# Altium schematic sheet CW_demcheva_ControlBoard_Sh1.SchDoc: =title_line_1 + title_line_2
size 840 x 594 mm; SheetNumber: 1
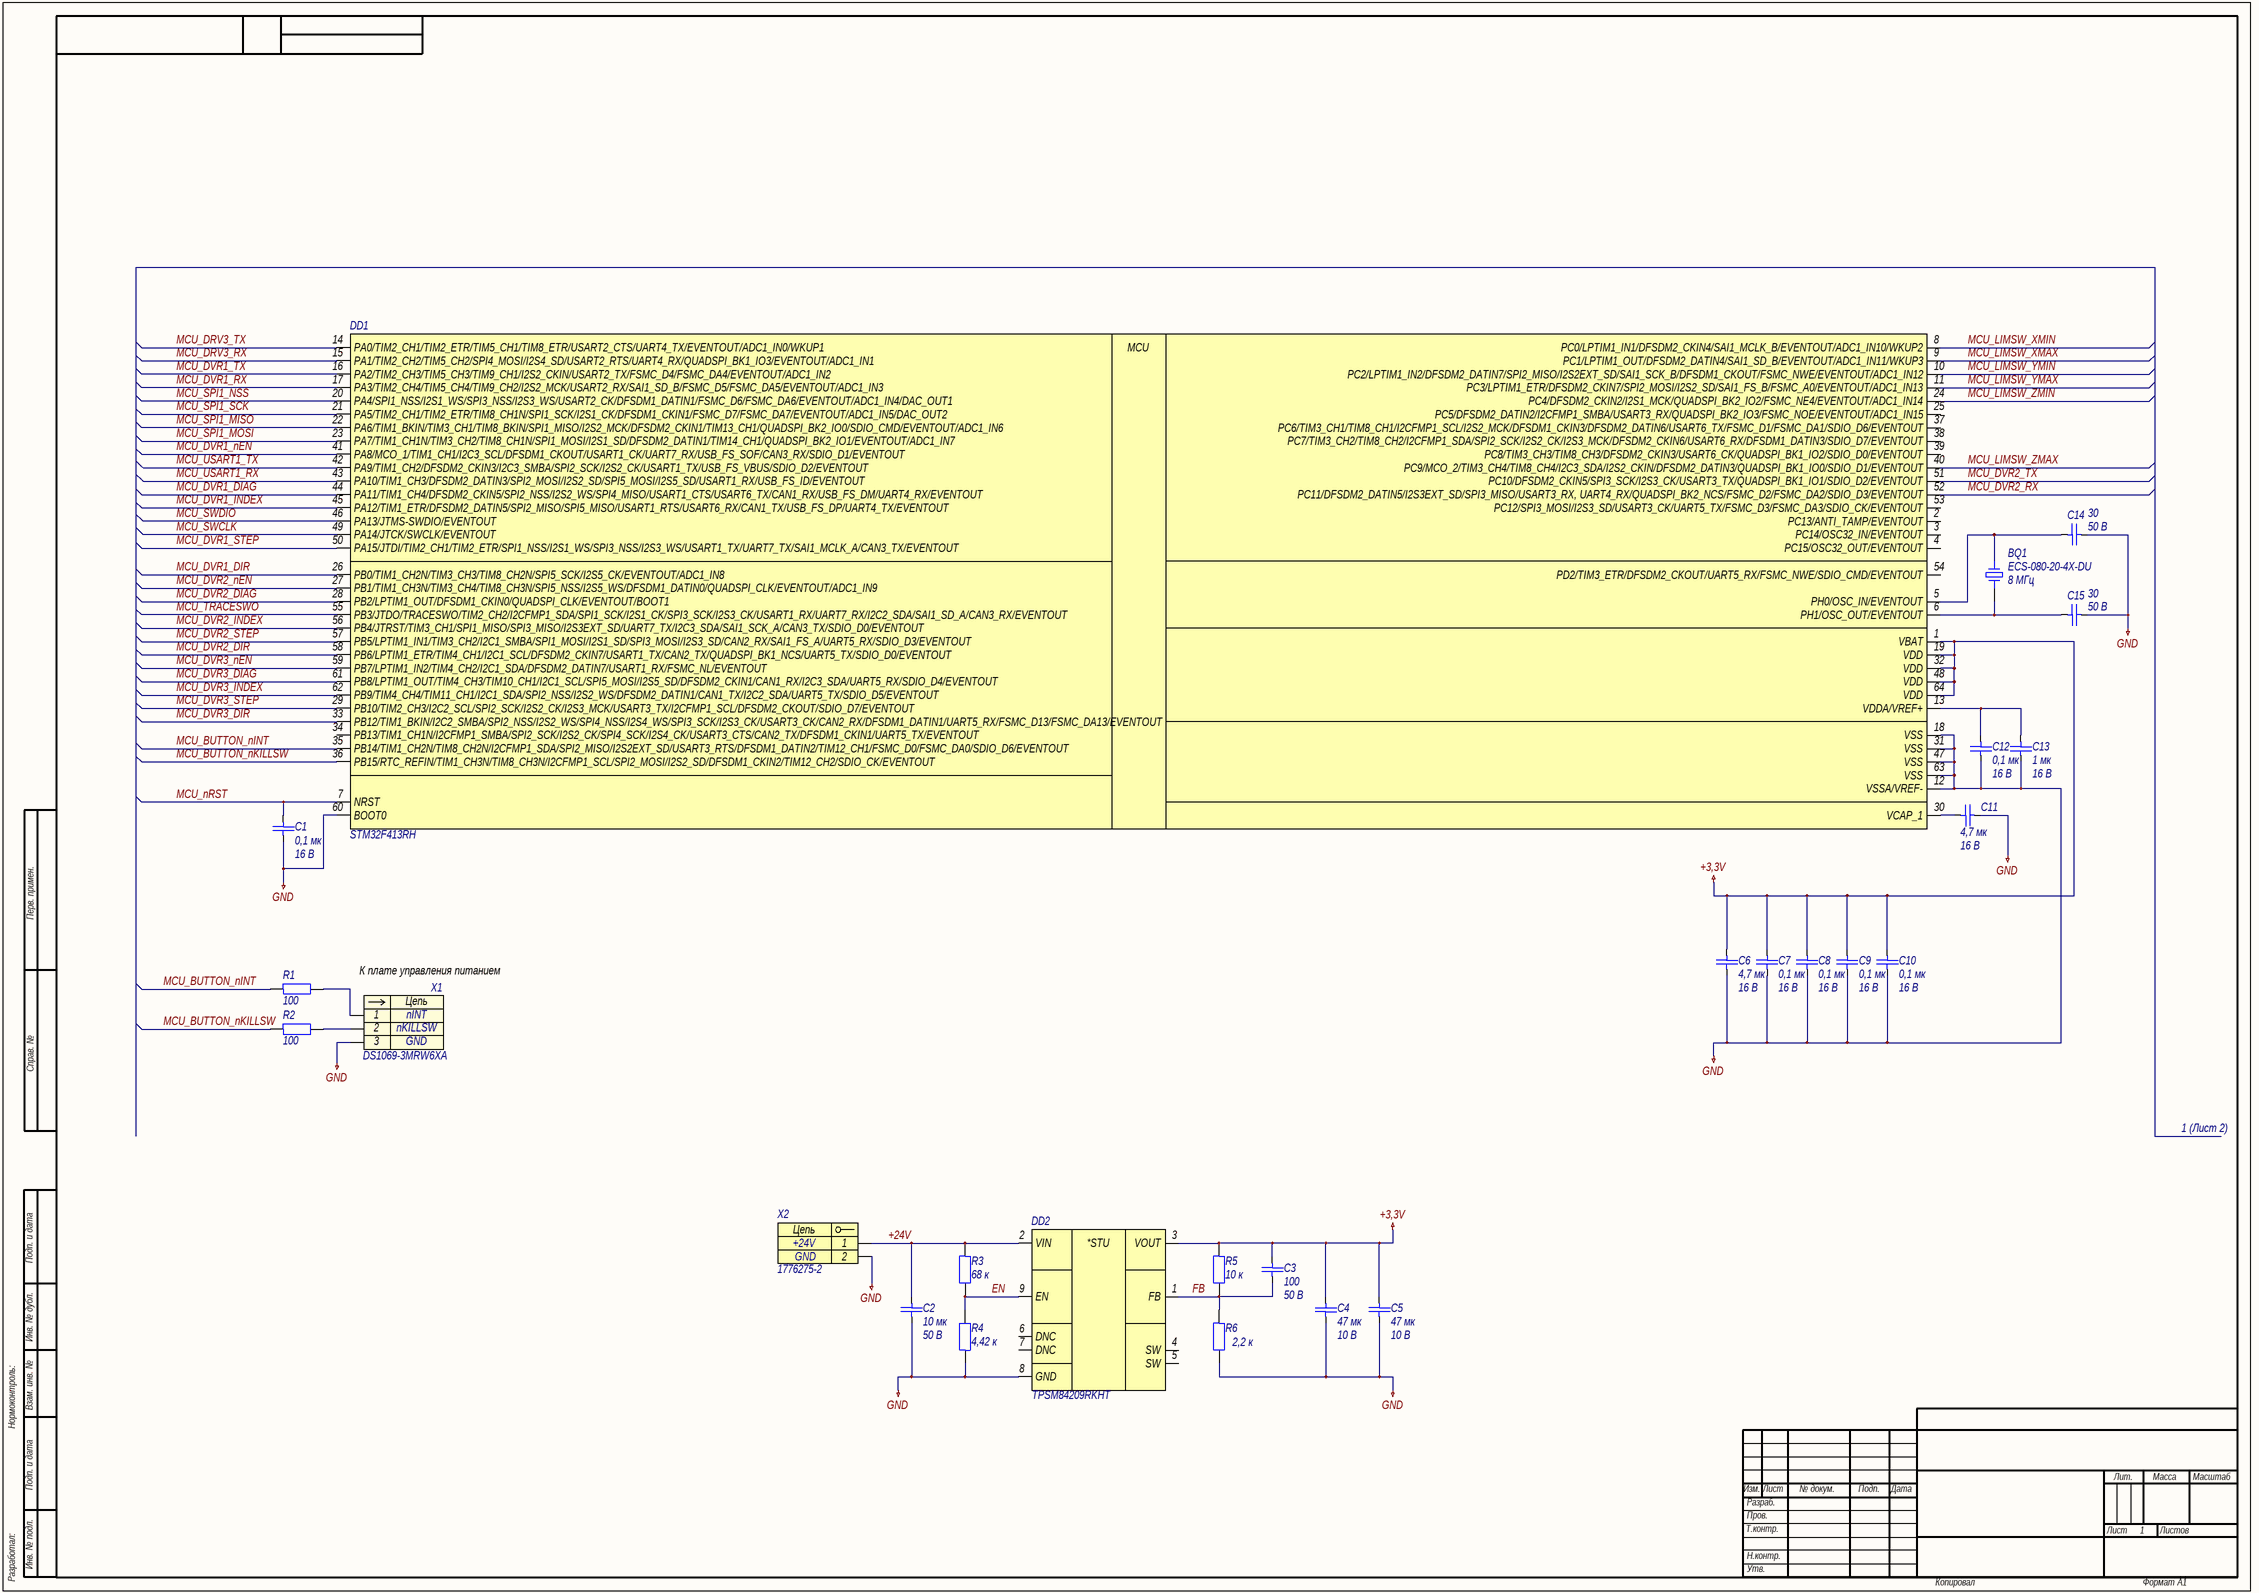
[diagram p0: CW_demcheva_ControlBoard_Sh1.SchDoc]

## Parts
BQ1  ECS-080-20-4X-DU  Частотa: 8 МГц  [HC-49/US]
C1  0,1 мк  Напряжение: 16 В  [C0603]
C2  10 мк  Напряжение: 50 В  [C0805]
C3  100  Напряжение: 50 В  [C0603]
C4  47 мк  Напряжение: 10 В  [C0805]
C5  47 мк  Напряжение: 10 В  [C0805]
C6  4,7 мк  Напряжение: 16 В  [C0805]
C7  0,1 мк  Напряжение: 16 В  [C0603]
C8  0,1 мк  Напряжение: 16 В  [C0603]
C9  0,1 мк  Напряжение: 16 В  [C0603]
C10  0,1 мк  Напряжение: 16 В  [C0603]
C11  4,7 мк  Напряжение: 16 В  [C0805]
C12  0,1 мк  Напряжение: 16 В  [C0603]
C13  1 мк  Напряжение: 16 В  [C0603]
C14  30  Напряжение: 50 В  [C0603]
C15  30  Напряжение: 50 В  [C0603]
DD1  STM32F413RH  [LQFP-64-P50-1000X1000X160-L60X22]
DD2  TPSM84209RKHT  [QFN-FCMOD-9-P65-450X400X210]
R1  100  [R0603]
R2  100  [R0603]
R3  68 к  [R0603]
R4  4,42 к  [R0603]
R5  10 к  [R0603]
R6  2,2 к  [R0603]
X1  DS1069-3MRW6XA  [DS1069-3MRW6XA]
X2  1776275-2  [1776275-2]

## Nets
+3,3V: C3.2 C4.1 C5.2 C6.2 C7.2 C8.2 C9.2 C10.2 DD1.1(VBAT) DD1.19(VDD) DD1.32(VDD) DD1.48(VDD) DD1.64(VDD) DD2.3(VOUT) R5.1
GND: C1.1 C2.1 C4.2 C5.1 C6.1 C7.1 C8.1 C9.1 C10.1 C11.1 C12.1 C13.1 C14.1 C15.1 DD1.12(VSSA/VREF-) DD1.18(VSS) DD1.31(VSS) DD1.47(VSS) DD1.60(BOOT0) DD1.63(VSS) DD2.8(GND) R4.1 R6.2 X1.3 X2.2
+24V: C2.2 DD2.2(VIN) R3.1 X2.1
EN: DD2.9(EN) R3.2 R4.2
FB: C3.1 DD2.1(FB) R5.2 R6.1
MCU_BUTTON_nINT: DD1.35(PB14/TIM1_CH2N/TIM8_CH2N/I2CFMP1_SDA/SPI2_MISO/I2S2EXT_SD/USART3_RTS/DFSDM1_DATIN2/TIM12_CH1/FSMC_D0/FSMC_DA0/SDIO_D6/EVENTOUT) R1.1
MCU_BUTTON_nKILLSW: DD1.36(PB15/RTC_REFIN/TIM1_CH3N/TIM8_CH3N/I2CFMP1_SCL/SPI2_MOSI/I2S2_SD/DFSDM1_CKIN2/TIM12_CH2/SDIO_CK/EVENTOUT) R2.1
MCU_DRV3_RX: DD1.15(PA1/TIM2_CH2/TIM5_CH2/SPI4_MOSI/I2S4_SD/USART2_RTS/UART4_RX/QUADSPI_BK1_IO3/EVENTOUT/ADC1_IN1)
MCU_DRV3_TX: DD1.14(PA0/TIM2_CH1/TIM2_ETR/TIM5_CH1/TIM8_ETR/USART2_CTS/UART4_TX/EVENTOUT/ADC1_IN0/WKUP1)
MCU_DVR1_DIAG: DD1.44(PA11/TIM1_CH4/DFSDM2_CKIN5/SPI2_NSS/I2S2_WS/SPI4_MISO/USART1_CTS/USART6_TX/CAN1_RX/USB_FS_DM/UART4_RX/EVENTOUT)
MCU_DVR1_DIR: DD1.26(PB0/TIM1_CH2N/TIM3_CH3/TIM8_CH2N/SPI5_SCK/I2S5_CK/EVENTOUT/ADC1_IN8)
MCU_DVR1_INDEX: DD1.45(PA12/TIM1_ETR/DFSDM2_DATIN5/SPI2_MISO/SPI5_MISO/USART1_RTS/USART6_RX/CAN1_TX/USB_FS_DP/UART4_TX/EVENTOUT)
MCU_DVR1_nEN: DD1.41(PA8/MCO_1/TIM1_CH1/I2C3_SCL/DFSDM1_CKOUT/USART1_CK/UART7_RX/USB_FS_SOF/CAN3_RX/SDIO_D1/EVENTOUT)
MCU_DVR1_RX: DD1.17(PA3/TIM2_CH4/TIM5_CH4/TIM9_CH2/I2S2_MCK/USART2_RX/SAI1_SD_B/FSMC_D5/FSMC_DA5/EVENTOUT/ADC1_IN3)
MCU_DVR1_STEP: DD1.50(PA15/JTDI/TIM2_CH1/TIM2_ETR/SPI1_NSS/I2S1_WS/SPI3_NSS/I2S3_WS/USART1_TX/UART7_TX/SAI1_MCLK_A/CAN3_TX/EVENTOUT)
MCU_DVR1_TX: DD1.16(PA2/TIM2_CH3/TIM5_CH3/TIM9_CH1/I2S2_CKIN/USART2_TX/FSMC_D4/FSMC_DA4/EVENTOUT/ADC1_IN2)
MCU_DVR2_DIAG: DD1.28(PB2/LPTIM1_OUT/DFSDM1_CKIN0/QUADSPI_CLK/EVENTOUT/BOOT1)
MCU_DVR2_DIR: DD1.58(PB6/LPTIM1_ETR/TIM4_CH1/I2C1_SCL/DFSDM2_CKIN7/USART1_TX/CAN2_TX/QUADSPI_BK1_NCS/UART5_TX/SDIO_D0/EVENTOUT)
MCU_DVR2_INDEX: DD1.56(PB4/JTRST/TIM3_CH1/SPI1_MISO/SPI3_MISO/I2S3EXT_SD/UART7_TX/I2C3_SDA/SAI1_SCK_A/CAN3_TX/SDIO_D0/EVENTOUT)
MCU_DVR2_nEN: DD1.27(PB1/TIM1_CH3N/TIM3_CH4/TIM8_CH3N/SPI5_NSS/I2S5_WS/DFSDM1_DATIN0/QUADSPI_CLK/EVENTOUT/ADC1_IN9)
MCU_DVR2_RX: DD1.52(PC11/DFSDM2_DATIN5/I2S3EXT_SD/SPI3_MISO/USART3_RX,_UART4_RX/QUADSPI_BK2_NCS/FSMC_D2/FSMC_DA2/SDIO_D3/EVENTOUT)
MCU_DVR2_STEP: DD1.57(PB5/LPTIM1_IN1/TIM3_CH2/I2C1_SMBA/SPI1_MOSI/I2S1_SD/SPI3_MOSI/I2S3_SD/CAN2_RX/SAI1_FS_A/UART5_RX/SDIO_D3/EVENTOUT)
MCU_DVR2_TX: DD1.51(PC10/DFSDM2_CKIN5/SPI3_SCK/I2S3_CK/USART3_TX/QUADSPI_BK1_IO1/SDIO_D2/EVENTOUT)
MCU_DVR3_DIAG: DD1.61(PB8/LPTIM1_OUT/TIM4_CH3/TIM10_CH1/I2C1_SCL/SPI5_MOSI/I2S5_SD/DFSDM2_CKIN1/CAN1_RX/I2C3_SDA/UART5_RX/SDIO_D4/EVENTOUT)
MCU_DVR3_DIR: DD1.33(PB12/TIM1_BKIN/I2C2_SMBA/SPI2_NSS/I2S2_WS/SPI4_NSS/I2S4_WS/SPI3_SCK/I2S3_CK/USART3_CK/CAN2_RX/DFSDM1_DATIN1/UART5_RX/FSMC_D13/FSMC_DA13/EVENTOUT)
MCU_DVR3_INDEX: DD1.62(PB9/TIM4_CH4/TIM11_CH1/I2C1_SDA/SPI2_NSS/I2S2_WS/DFSDM2_DATIN1/CAN1_TX/I2C2_SDA/UART5_TX/SDIO_D5/EVENTOUT)
MCU_DVR3_nEN: DD1.59(PB7/LPTIM1_IN2/TIM4_CH2/I2C1_SDA/DFSDM2_DATIN7/USART1_RX/FSMC_NL/EVENTOUT)
MCU_DVR3_STEP: DD1.29(PB10/TIM2_CH3/I2C2_SCL/SPI2_SCK/I2S2_CK/I2S3_MCK/USART3_TX/I2CFMP1_SCL/DFSDM2_CKOUT/SDIO_D7/EVENTOUT)
MCU_LIMSW_XMAX: DD1.9(PC1/LPTIM1_OUT/DFSDM2_DATIN4/SAI1_SD_B/EVENTOUT/ADC1_IN11/WKUP3)
MCU_LIMSW_XMIN: DD1.8(PC0/LPTIM1_IN1/DFSDM2_CKIN4/SAI1_MCLK_B/EVENTOUT/ADC1_IN10/WKUP2)
MCU_LIMSW_YMAX: DD1.11(PC3/LPTIM1_ETR/DFSDM2_CKIN7/SPI2_MOSI/I2S2_SD/SAI1_FS_B/FSMC_A0/EVENTOUT/ADC1_IN13)
MCU_LIMSW_YMIN: DD1.10(PC2/LPTIM1_IN2/DFSDM2_DATIN7/SPI2_MISO/I2S2EXT_SD/SAI1_SCK_B/DFSDM1_CKOUT/FSMC_NWE/EVENTOUT/ADC1_IN12)
MCU_LIMSW_ZMAX: DD1.40(PC9/MCO_2/TIM3_CH4/TIM8_CH4/I2C3_SDA/I2S2_CKIN/DFSDM2_DATIN3/QUADSPI_BK1_IO0/SDIO_D1/EVENTOUT)
MCU_LIMSW_ZMIN: DD1.24(PC4/DFSDM2_CKIN2/I2S1_MCK/QUADSPI_BK2_IO2/FSMC_NE4/EVENTOUT/ADC1_IN14)
MCU_nRST: C1.2 DD1.7(NRST)
MCU_SPI1_MISO: DD1.22(PA6/TIM1_BKIN/TIM3_CH1/TIM8_BKIN/SPI1_MISO/I2S2_MCK/DFSDM2_CKIN1/TIM13_CH1/QUADSPI_BK2_IO0/SDIO_CMD/EVENTOUT/ADC1_IN6)
MCU_SPI1_MOSI: DD1.23(PA7/TIM1_CH1N/TIM3_CH2/TIM8_CH1N/SPI1_MOSI/I2S1_SD/DFSDM2_DATIN1/TIM14_CH1/QUADSPI_BK2_IO1/EVENTOUT/ADC1_IN7)
MCU_SPI1_NSS: DD1.20(PA4/SPI1_NSS/I2S1_WS/SPI3_NSS/I2S3_WS/USART2_CK/DFSDM1_DATIN1/FSMC_D6/FSMC_DA6/EVENTOUT/ADC1_IN4/DAC_OUT1)
MCU_SPI1_SCK: DD1.21(PA5/TIM2_CH1/TIM2_ETR/TIM8_CH1N/SPI1_SCK/I2S1_CK/DFSDM1_CKIN1/FSMC_D7/FSMC_DA7/EVENTOUT/ADC1_IN5/DAC_OUT2)
MCU_SWCLK: DD1.49(PA14/JTCK/SWCLK/EVENTOUT)
MCU_SWDIO: DD1.46(PA13/JTMS-SWDIO/EVENTOUT)
MCU_TRACESWO: DD1.55(PB3/JTDO/TRACESWO/TIM2_CH2/I2CFMP1_SDA/SPI1_SCK/I2S1_CK/SPI3_SCK/I2S3_CK/USART1_RX/UART7_RX/I2C2_SDA/SAI1_SD_A/CAN3_RX/EVENTOUT)
MCU_USART1_RX: DD1.43(PA10/TIM1_CH3/DFSDM2_DATIN3/SPI2_MOSI/I2S2_SD/SPI5_MOSI/I2S5_SD/USART1_RX/USB_FS_ID/EVENTOUT)
MCU_USART1_TX: DD1.42(PA9/TIM1_CH2/DFSDM2_CKIN3/I2C3_SMBA/SPI2_SCK/I2S2_CK/USART1_TX/USB_FS_VBUS/SDIO_D2/EVENTOUT)
NetBQ1_1: BQ1.1 C14.2 DD1.5(PH0/OSC_IN/EVENTOUT)
NetBQ1_2: BQ1.2 C15.2 DD1.6(PH1/OSC_OUT/EVENTOUT)
NetC11_2: C11.2 DD1.30(VCAP_1)
NetC12_2: C12.2 C13.2 DD1.13(VDDA/VREF+)
NetR1_2: R1.2 X1.1
NetR2_2: R2.2 X1.2

Not connected (* = marked no-connect by the designer): DD1 2(PC13/ANTI_TAMP/EVENTOUT) 3(PC14/OSC32_IN/EVENTOUT) 4(PC15/OSC32_OUT/EVENTOUT) 25(PC5/DFSDM2_DATIN2/I2CFMP1_SMBA/USART3_RX/QUADSPI_BK2_IO3/FSMC_NOE/EVENTOUT/ADC1_IN15) 34(PB13/TIM1_CH1N/I2CFMP1_SMBA/SPI2_SCK/I2S2_CK/SPI4_SCK/I2S4_CK/USART3_CTS/CAN2_TX/DFSDM1_CKIN1/UART5_TX/EVENTOUT) 37(PC6/TIM3_CH1/TIM8_CH1/I2CFMP1_SCL/I2S2_MCK/DFSDM1_CKIN3/DFSDM2_DATIN6/USART6_TX/FSMC_D1/FSMC_DA1/SDIO_D6/EVENTOUT) 38(PC7/TIM3_CH2/TIM8_CH2/I2CFMP1_SDA/SPI2_SCK/I2S2_CK/I2S3_MCK/DFSDM2_CKIN6/USART6_RX/DFSDM1_DATIN3/SDIO_D7/EVENTOUT) 39(PC8/TIM3_CH3/TIM8_CH3/DFSDM2_CKIN3/USART6_CK/QUADSPI_BK1_IO2/SDIO_D0/EVENTOUT) 53(PC12/SPI3_MOSI/I2S3_SD/USART3_CK/UART5_TX/FSMC_D3/FSMC_DA3/SDIO_CK/EVENTOUT) 54(PD2/TIM3_ETR/DFSDM2_CKOUT/UART5_RX/FSMC_NWE/SDIO_CMD/EVENTOUT); DD2 4(SW) 5(SW) 6(DNC) 7(DNC)

## Notes on the sheet
- К плате управления питанием
- 1 (Лист 2)
- Перв. примен.
- Справ. №
- Подп. и дата
- Инв. № дубл.
- Нормоконтроль:
- Взам. инв. №
- Изм.
- Лист
- № докум.
- Подп.
- Дата
- Лит.
- Масса
- Масштаб
- Т.контр.
- Пров.
- Разраб.
- Листов
- Разработал:
- Инв. № подл.
- Н.контр.
- Утв.
- Копировал
- Формат
- А1
- (in symbol dd0004) MCU
- (in symbol dd0020) *STU
- (in symbol x0008) Цепь
- (in symbol x0042) Цепь

## Library data of the parts
BQ1 = bq0004: =Описание; ID: bq0004; Фамилия: Паньков; Описание: Кварцевый резонатор 8 МГц нагрузочные конденсаторы 20 пФ; Производитель: ECS, Inc. International; Наименование: ECS-080-20-4X-DU; Частота: 8 МГц; Корпус: HC-49/US; HelpURL: https://ecsxtal.com/hc-49usx
C1 C7-C10 C12 = c0063: =Описание; ID: c0063; Фамилия: Паньков; Описание: Конденсатор керамический чип 0603 100 нФ 16 В ±10 %; Наименование: CC0603KRX7R7BB104; Производитель: YAGEO Corp.; Отклонение: ±10 %; Рабочие температуры: от –55 °С до +125 °С; Температурный коэффициент емкости: X7R; Корпус: 0603; Номинал: 0,1 мк; Номинальное напряжение: 16 В; HelpURL: https://www.yageo.com/upload/media/product/productsearch/datasheet/mlcc/UPY-GPHC_X7R_6.3V-to-50V_20.pdf
C2 = c0131: =Описание; ID: c0131; Фамилия: Паньков; Описание: Конденсатор керамический чип 0805 10 мкФ 50 В ±10 %; Наименование: CC0805KKX5R9BB106; Производитель: YAGEO Corp.; Отклонение: ±10 %; Рабочие температуры: от –55 °С до +85 °С; Температурный коэффициент емкости: X5R; Корпус: 0805; Номинал: 10 мк; Номинальное напряжение: 50 В; HelpURL: https://www.yageo.com/upload/media/product/productsearch/datasheet/mlcc/UPY-GPHC_X5R_4V-to-50V_26.pdf
C3 = c0016: =Описание; ID: c0016; Фамилия: Ларионов; Описание: Конденсатор керамический чип 0603 100 пФ 50 В ±5 %; Наименование: CC0603JPX7R9BB101; Производитель: YAGEO Corp.; Отклонение: ±5 %; Рабочие температуры: от –55 °С до +125 °С; Температурный коэффициент емкости: X7R; Корпус: 0603; Номинал: 100; Номинальное напряжение: 50 В; HelpURL: https://www.yageo.com/upload/media/product/productsearch/datasheet/mlcc/UPY-GPHC_X7R_6.3V-to-50V_20.pdf
C4 C5 = c0149: =Описание; ID: c0149; Фамилия: Паньков; Описание: Конденсатор керамический чип 0805 47 мкФ 10 В ±20 %; Наименование: CC0805MKX5R6BB476; Производитель: YAGEO Corp.; Отклонение: ±20 %; Рабочие температуры: от –55 °С до +85 °С; Температурный коэффициент емкости: X5R; Корпус: 0805; Номинал: 47 мк; Номинальное напряжение: 10 В; HelpURL: https://www.yageo.com/upload/media/product/productsearch/datasheet/mlcc/UPY-GPHC_X5R_4V-to-50V_26.pdf
C6 C11 = c0117: =Описание; ID: c0117; Фамилия: Паньков; Описание: Конденсатор керамический чип 0805 4,7 мкФ 16 В ±10 %; Наименование: CC0805KKX7R7BB475; Производитель: YAGEO Corp.; Отклонение: ±10 %; Рабочие температуры: от –55 °С до +125 °С; Температурный коэффициент емкости: X7R; Корпус: 0805; Номинал: 4,7 мк; Номинальное напряжение: 16 В; HelpURL: https://www.yageo.com/upload/media/product/productsearch/datasheet/mlcc/UPY-GPHC_X7R_6.3V-to-50V_20.pdf
C13 = c0095: =Описание; ID: c0095; Фамилия: Паньков; Описание: Конденсатор керамический чип 0603 1 мкФ 16 В ±10 %; Наименование: CC0603KRX7R7BB105; Производитель: YAGEO Corp.; Отклонение: ±10 %; Рабочие температуры: от –55 °С до +125 °С; Температурный коэффициент емкости: X7R; Корпус: 0603; Номинал: 1 мк; Номинальное напряжение: 16 В; HelpURL: https://www.yageo.com/upload/media/product/productsearch/datasheet/mlcc/UPY-GPHC_X7R_6.3V-to-50V_20.pdf
C14 C15 = c0160: =Описание; ID: c0160; Фамилия: Демчева; Описание: Конденсатор керамический чип 0603 30 пФ 50 В ±5 %; Наименование: GRM1885C1H300JA01J; Производитель: Murata Manufacturing Co., Ltd.; Отклонение: ±5 %; Рабочие температуры: от –55 °С до +125 °С; Температурный коэффициент емкости: C0G; Корпус: 0603; Номинал: 30; Номинальное напряжение: 50 В; HelpURL: https://ru.mouser.com/datasheet/2/281/1/GRM1885C1H300JA01_01A-1984810.pdf
DD1 = dd0004: =Описание; ID: dd0004; Фамилия: Демчева; Описание: ARM Cortex-M4 32-разрядный микроконтроллер 100 МГц 1 Мбайт FLASH-памяти; Производитель: STMicroelectronics; Рабочее напряжение: от 1,7 В до 3,6 В; Максимальная тактовая частота: 100 МГц; Поддерживаемые интерфейсы: CAN, I2C, SDIO, I2S/SPI, UART/USART, USB; Рабочие температуры: от –40 °С до +85 °С; Корпус: LQFP-64; Наименование: STM32F413RH; HelpURL: https://www.st.com/en/microcontrollers-microprocessors/stm32f413rh.html
DD2 = dd0020: =Описание; ID: dd0020; Фамилия: Паньков; Описание: Понижающий преобразователь напряжения 4,5…28 В / 1,2…6,0 В и 2,5 А; Производитель: Texas Instruments Inc.; Входное напряжение: от 4,5 В до 28 В; Выходное напряжение: от 1,2 до 6,0 В; Коммутируемый ток: до 2,5 А; Частота переключения: от 578 кГц до 923 кГц; Рабочие температуры: от –40 °С до +85 °С; Корпус: QFN-FCMOD-16; Наименование: TPSM84209RKHT; HelpURL: https://www.ti.com/product/TPSM84209
R1 R2 = r0052: =Описание; ID: r0052; Фамилия: Самарин; Описание: Резистор чип 0603 100 Ом ±1 % 0,1 Вт; Наименование: RC0603FR‍‐07100RL; Производитель: YAGEO Corp.; Отклонение: ±1 %; Номинальное напряжение: 75 В; Номинальный ток: 1 А; Рабочие температуры: от –55 °С до +155 °С; Корпус: 0603; Примечание: Ряд E24; Номинал: 100; HelpURL: https://www.yageo.com/upload/media/product/productsearch/datasheet/rchip/PYu-RC_Group_51_RoHS_L_11.pdf
R3 = r0136: =Описание; ID: r0136; Фамилия: Паньков; Описание: Резистор чип 0603 68 кОм ±1 % 0,1 Вт; Наименование: RC0603FR-0768KL; Производитель: YAGEO Corp.; Отклонение: ±1 %; Номинальное напряжение: 75 В; Номинальный ток: 1 А; Рабочие температуры: от –55 °С до +155 °С; Корпус: 0603; Примечание: Ряд E24; Номинал: 68 к; HelpURL: https://www.yageo.com/upload/media/product/productsearch/datasheet/rchip/PYu-RC_Group_51_RoHS_L_11.pdf
R4 = r0093: =Описание; ID: r0093; Фамилия: Жернаков; Описание: Резистор чип 0603 4,42 кОм ±1 % 0,1 Вт; Наименование: RC0603FR-074K42L; Производитель: YAGEO Corp.; Отклонение: ±1 %; Номинальное напряжение: 75 В; Номинальный ток: 1 А; Рабочие температуры: от –55 °С до +155 °С; Корпус: 0603; Номинал: 4,42 к; HelpURL: https://www.yageo.com/upload/media/product/productsearch/datasheet/rchip/PYu-RC_Group_51_RoHS_L_11.pdf
R5 = r0105: =Описание; ID: r0105; Фамилия: Самарин; Описание: Резистор чип 0603 10 кОм ±1 % 0,1 Вт; Наименование: RC0603FR-0710KL; Производитель: YAGEO Corp.; Отклонение: ±1 %; Номинальное напряжение: 75 В; Номинальный ток: 1 А; Рабочие температуры: от –55 °С до +155 °С; Корпус: 0603; Примечание: Ряд E24; Номинал: 10 к; HelpURL: https://www.yageo.com/upload/media/product/productsearch/datasheet/rchip/PYu-RC_Group_51_RoHS_L_11.pdf
R6 = r0085: =Описание; ID: r0085; Фамилия: Паньков; Описание: Резистор чип 0603 2,2 кОм ±1 % 0,1 Вт; Наименование: RC0603FR-072K2L; Производитель: YAGEO Corp.; Отклонение: ±1 %; Номинальное напряжение: 75 В; Номинальный ток: 1 А; Рабочие температуры: от –55 °С до +155 °С; Корпус: 0603; Примечание: Ряд E24; Номинал: 2,2 к; HelpURL: https://www.yageo.com/upload/media/product/productsearch/datasheet/rchip/PYu-RC_Group_51_RoHS_L_11.pdf
X1 = x0042: =Описание; Contact_1: nINT; Contact_2: nKILLSW; Contact_3: GND; ID: x0042; Фамилия: Паньков; Описание: CWF 3 pin Type A 2,5 мм вилка угловой; Производитель: Connfly Electronic Co., Ltd.; Наименование: DS1069-3MRW6XA; HelpURL: http://en.connfly.group/product/xVkr=EusQssAN0gN=Aos=mU+UrVkR9kqEAN0gN0MUR+g+NB+A
X2 = x0008: =Описание; Contact_1: +24V; Contact_2: GND; ID: x0008; Фамилия: Паньков; Описание: Terminal Block 2 pin 3,5 мм; Производитель: TE Connectivity; Наименование: 1776275-2; HelpURL: https://www.te.com/usa-en/product-1776275-2.html